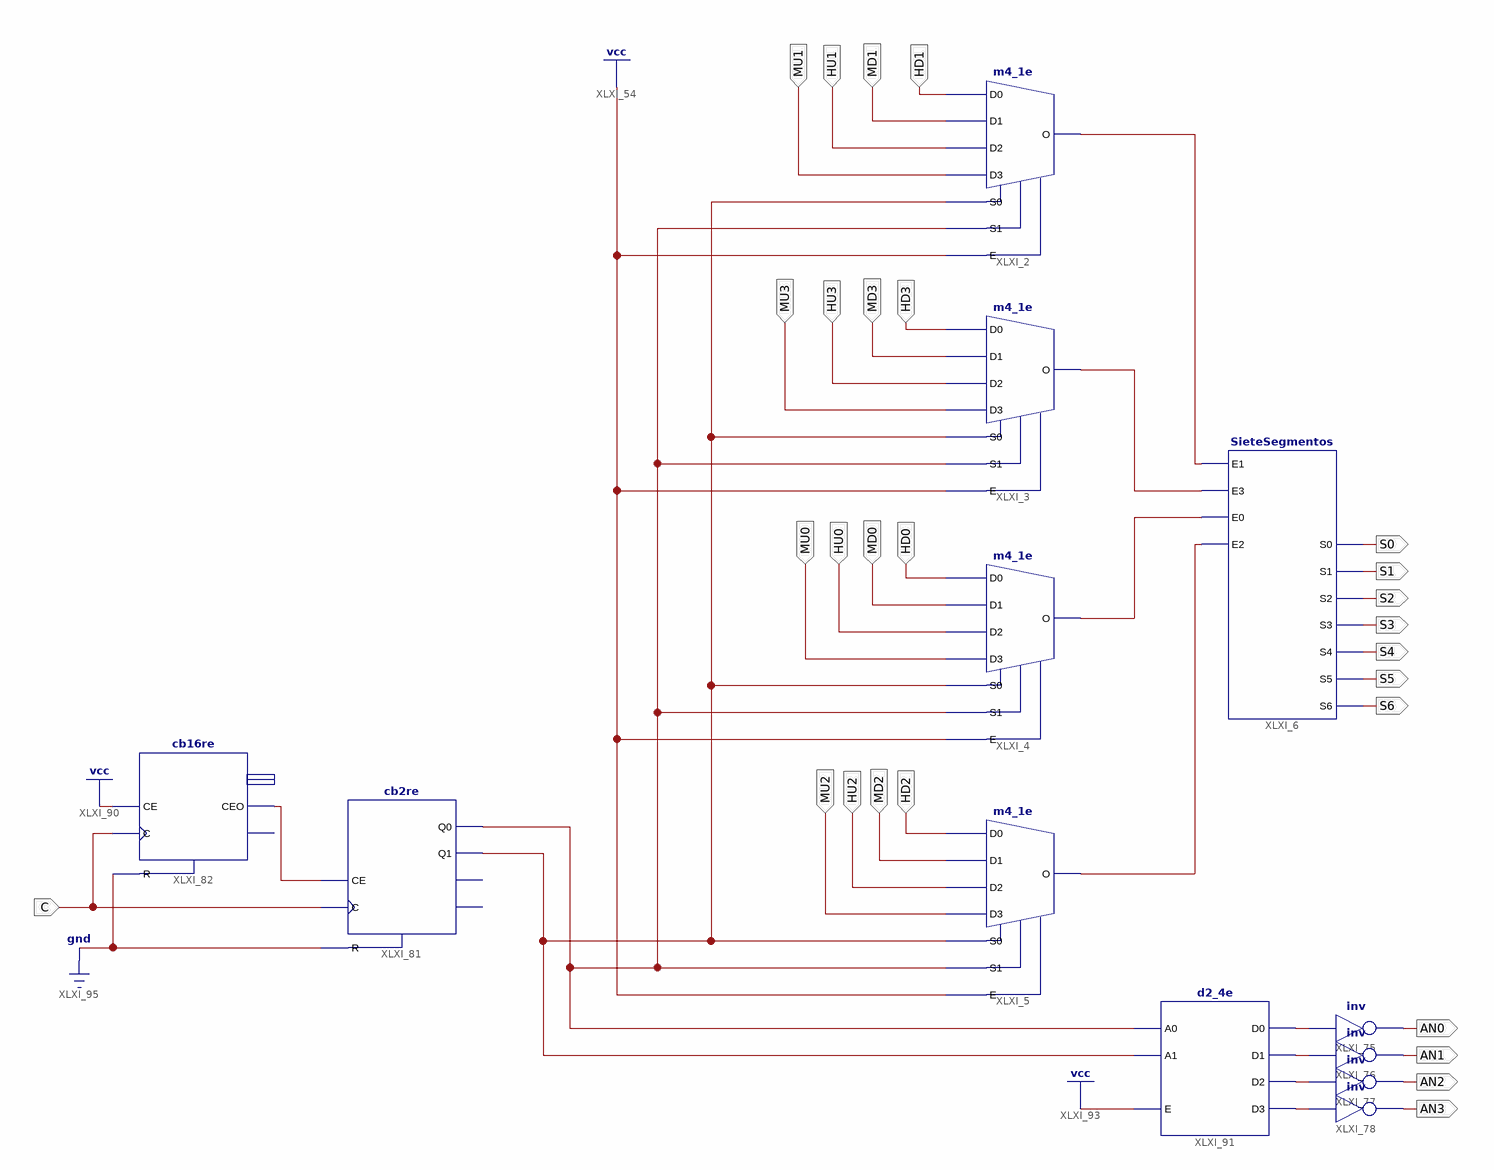
[diagram p0: schematic sheet 1]
// Xilinx ISE schematic Circuito.sch (spartan3e) as structural Verilog: 12 symbols, 28 ports
module Circuito (
  input  MU1,
  input  HD3,
  input  MD3,
  input  HU3,
  input  HD0,
  input  MD0,
  input  HU0,
  input  MU0,
  input  HD2,
  input  MD2,
  input  HU2,
  input  MU2,
  input  HU1,
  input  MD1,
  input  C,
  input  HD1,
  input  MU3,
  output S0,
  output S1,
  output S2,
  output S3,
  output S4,
  output S5,
  output S6,
  output AN0,
  output AN1,
  output AN2,
  output AN3
);

  wire XLXN_1, XLXN_2, XLXN_3, XLXN_4, XLXN_145, XLXN_216, XLXN_217, XLXN_218, XLXN_219, XLXN_263, XLXN_264;

  SieteSegmentos XLXI_6 (
    .E1(XLXN_1), .E3(XLXN_2), .E2(XLXN_4), .E0(XLXN_3), .S0(S0), .S1(S1), .S2(S2), .S3(S3), .S4(S4), .S5(S5),
    .S6(S6));
  m4_1e XLXI_2 (.D0(HD1), .D1(MD1), .D2(HU1), .D3(MU1), .E(1'b1), .S0(XLXN_264), .S1(XLXN_263), .O(XLXN_1));
  m4_1e XLXI_3 (.D0(HD3), .D1(MD3), .D2(HU3), .D3(MU3), .E(1'b1), .S0(XLXN_264), .S1(XLXN_263), .O(XLXN_2));
  m4_1e XLXI_4 (.D0(HD0), .D1(MD0), .D2(HU0), .D3(MU0), .E(1'b1), .S0(XLXN_264), .S1(XLXN_263), .O(XLXN_3));
  m4_1e XLXI_5 (.D0(HD2), .D1(MD2), .D2(HU2), .D3(MU2), .E(1'b1), .S0(XLXN_264), .S1(XLXN_263), .O(XLXN_4));
  not XLXI_75 (AN0, XLXN_216);
  not XLXI_76 (AN1, XLXN_217);
  not XLXI_77 (AN2, XLXN_218);
  not XLXI_78 (AN3, XLXN_219);
  d2_4e XLXI_91 (.A0(XLXN_263), .A1(XLXN_264), .E(1'b1), .D0(XLXN_216), .D1(XLXN_217), .D2(XLXN_218), .D3(XLXN_219));
  cb2re XLXI_81 (.C(C), .CE(XLXN_145), .R(1'b0), .Q0(XLXN_263), .Q1(XLXN_264));  // open: CEO, TC
  cb16re XLXI_82 (.C(C), .CE(1'b1), .R(1'b0), .CEO(XLXN_145));  // open: Q, TC
endmodule
